# EAGLE design Zynthian_MCP23017 (EAGLE 8.7.0)
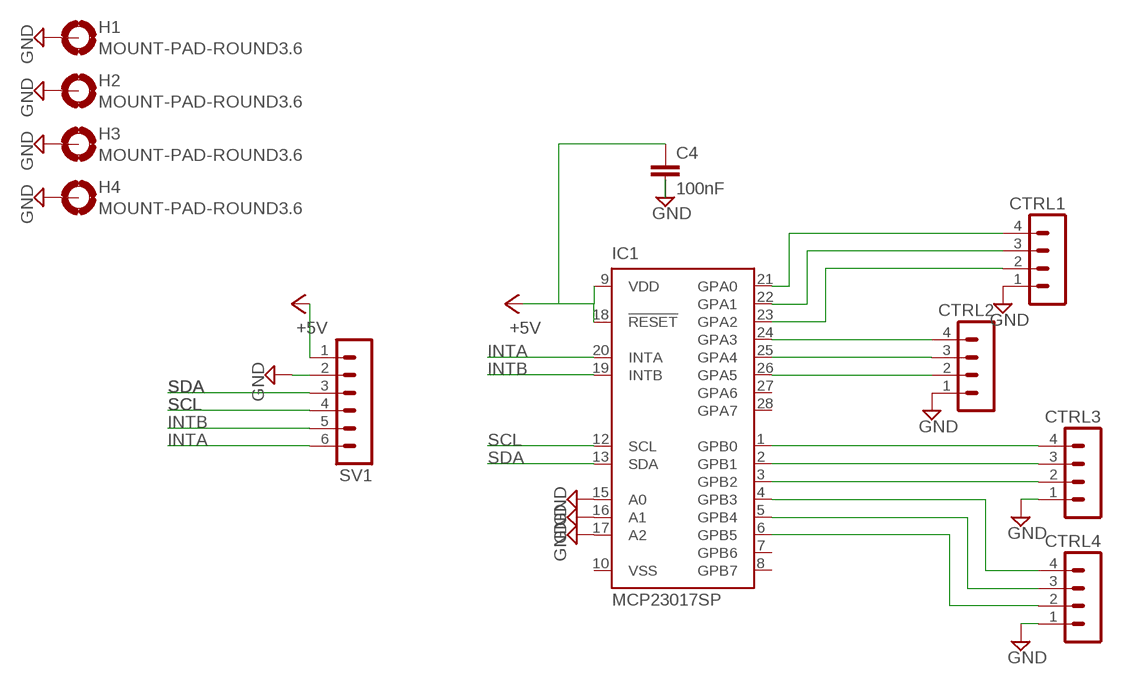
[diagram p0: schematic, sheet 1]

## Parts
C4  100nF  072X0252  [072X025]
CTRL1  MA04-1  [MA04-1]
CTRL2  MA04-1  [MA04-1]
CTRL3  MA04-1  [MA04-1]
CTRL4  MA04-1  [MA04-1]
H1  MOUNT-PAD-ROUND3.6  [3,6-PAD]
H2  MOUNT-PAD-ROUND3.6  [3,6-PAD]
H3  MOUNT-PAD-ROUND3.6  [3,6-PAD]
H4  MOUNT-PAD-ROUND3.6  [3,6-PAD]
IC1  MCP23017SP  [DIL28-3]
SV1  MA06-1  [MA06-1]

## Nets
+5V: C4.1 IC1.9(VDD) IC1.18(!RESET) SV1.1
GND: C4.2 CTRL1.1 CTRL2.1 CTRL3.1 CTRL4.1 H1.B3,6(MOUNT) H2.B3,6(MOUNT) H3.B3,6(MOUNT) H4.B3,6(MOUNT) IC1.15(A0) IC1.16(A1) IC1.17(A2) SV1.2
INTA: IC1.20(INTA) SV1.6
INTB: IC1.19(INTB) SV1.5
N$1: CTRL1.4 IC1.21(GPA0)
N$2: CTRL1.3 IC1.22(GPA1)
N$3: CTRL1.2 IC1.23(GPA2)
N$4: CTRL2.4 IC1.24(GPA3)
N$5: CTRL2.3 IC1.25(GPA4)
N$6: CTRL2.2 IC1.26(GPA5)
N$7: CTRL3.4 IC1.1(GPB0)
N$8: CTRL3.3 IC1.2(GPB1)
N$9: CTRL3.2 IC1.3(GPB2)
N$10: CTRL4.4 IC1.4(GPB3)
N$11: CTRL4.3 IC1.5(GPB4)
N$12: CTRL4.2 IC1.6(GPB5)
SCL: IC1.12(SCL) SV1.4
SDA: IC1.13(SDA) SV1.3
Unconnected: IC1.7(GPB6) IC1.8(GPB7) IC1.27(GPA6) IC1.28(GPA7)

## Power pins joined to a net without a drawn wire
VSS: IC1.10(VSS)

## Library data of the parts
C4 = gm-caps-film-box:072X025: 1000pF - 0.47uF WIMA MKP2 63, 100V: 1000pF - 0.015uF; MKS2 50V: 0.33 - 0.47uF; 63V: 1000pF - 0.22uF;
CTRL1-CTRL4 = con-lstb:MA04-1: PIN HEADER; OC_FARNELL: unknown; OC_NEWARK: unknown
H1-H4 = holes:MOUNT-PAD-ROUND: MOUNTING PAD, round
IC1 = adafruit:MCP23017: http://ww1.microchip.com/downloads/en/DeviceDoc/21952a.pdf Source: http://ww1.microchip.com/downloads/en/DeviceDoc/21952a.pdf
SV1 = con-lstb:MA06-1: PIN HEADER; OC_FARNELL: unknown; OC_NEWARK: unknown

## Board
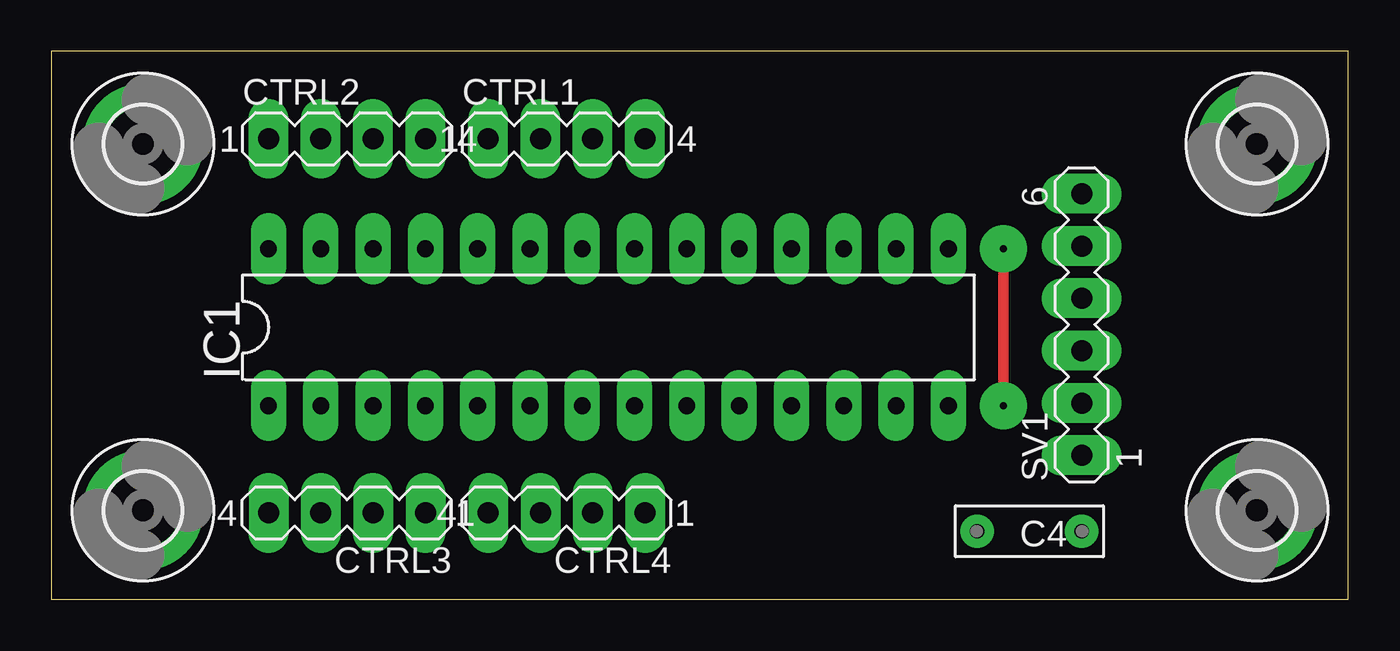
[diagram p1: board, top side]
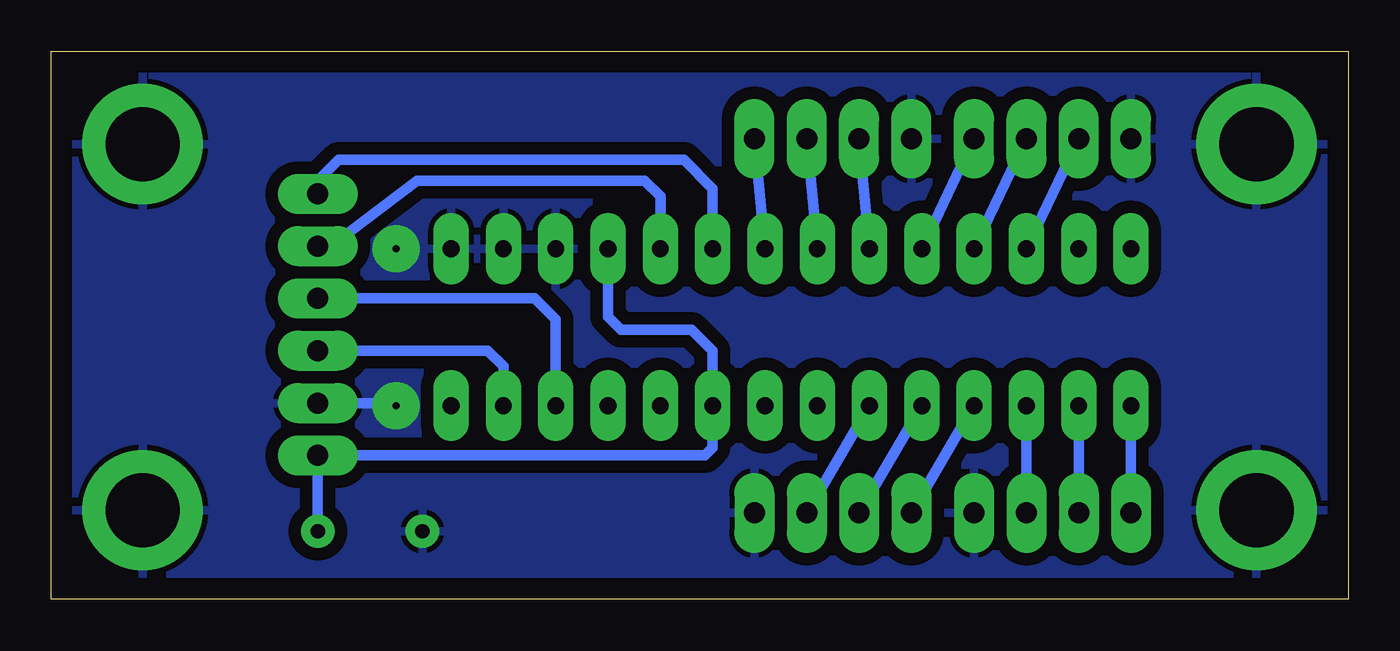
[diagram p2: board, bottom side, seen from below]

Size 62.97 x 26.59 mm. Coordinates in mm from the lower left corner, seen from the top.
Outline: 0,0 62.97,0 62.97,26.59 0,26.59 0,0
Copper layers (1*16): Top 0.035mm / dielectric 1.5mm / Bottom 0.035mm
Design rules "default *": minimum track width 20mil, minimum drill 24mil, track to track 8mil, track to pad 8mil, pad to pad 8mil, via to via 8mil, smd to smd 8mil, copper to edge 40mil, drill to drill 8mil, minimum pad ring 18mil, minimum via ring 8mil, stop-mask expansion 4mil, vias tented up to drill 0mil, thermal gap 10mil

### Footprints (pad centres in the part's own frame; a part is rotated, then mirrored left to right if it is on the bottom)
072X025 = drill 0.7: 1 -2.54,0; 2 2.54,0
MA04-1 = drill 1.016 long: 1 -3.81,0; 2 -1.27,0; 3 1.27,0; 4 3.81,0
3,6-PAD = drill 3.6 pad 5.842: B3,6 0,0
DIL28-3 = drill 0.813 long: 1 -16.51,-3.81; 2 -13.97,-3.81; 3 -11.43,-3.81; 4 -8.89,-3.81; 5 -6.35,-3.81; 6 -3.81,-3.81; 7 -1.27,-3.81; 8 1.27,-3.81; 9 3.81,-3.81; 10 6.35,-3.81; 11 8.89,-3.81; 12 11.43,-3.81; 13 13.97,-3.81; 14 16.51,-3.81; 15 16.51,3.81; 16 13.97,3.81; 17 11.43,3.81; 18 8.89,3.81; 19 6.35,3.81; 20 3.81,3.81; 21 1.27,3.81; 22 -1.27,3.81; 23 -3.81,3.81; 24 -6.35,3.81; 25 -8.89,3.81; 26 -11.43,3.81; 27 -13.97,3.81; 28 -16.51,3.81
MA06-1 = drill 1.016 long: 1 -6.35,0; 2 -3.81,0; 3 -1.27,0; 4 1.27,0; 5 3.81,0; 6 6.35,0

### Placement (x,y rotation side)
C4  47.5,3.3 180 top
CTRL1  25.02,22.35 0 top
CTRL2  14.35,22.35 0 top
CTRL3  14.35,4.19 180 top
CTRL4  25.02,4.19 180 top
H1  4.45,4.32 0 top
H2  4.45,22.1 0 top
H3  58.55,22.1 0 top
H4  58.55,4.32 0 top
IC1  27.05,13.21 0 top
SV1  50.04,13.33 90 top

### Tracks (layer width: path | path; a pad name or v marks a point on that pad's centre or on a via)
+5V
  Bottom 0.508: IC1.18 35.94,13.72 35.31,13.08 31.88,13.08 30.86,12.06 IC1.9 30.86,7.37 31.24,6.98 SV1.1 C4.1
GND  (via drill 0.35 pad 2.29)
  Top 0.508: v46.23,17.02 v46.23,9.4
  Bottom 0.508: SV1.2 46.74,9.53
  pour Bottom (isolate 0.61): -14.61,33.66 76.96,33.4 76.96,-6.86 -14.61,-6.6
INTA
  Bottom 0.508: IC1.20 30.86,19.94 32.26,21.34 49.02,21.34 50.04,20.32 SV1.6
INTB
  Bottom 0.508: IC1.19 33.4,19.56 34.16,20.32 45.21,20.32 49.4,17.14 SV1.5
N$1
  Bottom 0.508: CTRL1.4 IC1.21
N$2
  Bottom 0.508: CTRL1.3 IC1.22
N$3
  Bottom 0.508: CTRL1.2 IC1.23
N$4
  Bottom 0.508: IC1.24 CTRL2.4
N$5
  Bottom 0.508: CTRL2.3 IC1.25
N$6
  Bottom 0.508: IC1.26 CTRL2.2
N$7
  Bottom 0.508: CTRL3.4 IC1.1
N$8
  Bottom 0.508: IC1.2 CTRL3.3
N$9
  Bottom 0.508: IC1.3 CTRL3.2
N$10
  Bottom 0.508: CTRL4.4 IC1.4
N$11
  Bottom 0.508: IC1.5 CTRL4.3
N$12
  Bottom 0.508: IC1.6 CTRL4.2
SCL
  Bottom 0.508: SV1.4 39.5,14.6 38.48,13.59 IC1.12
SDA
  Bottom 0.508: SV1.3 41.78,12.06 41.02,11.3 IC1.13